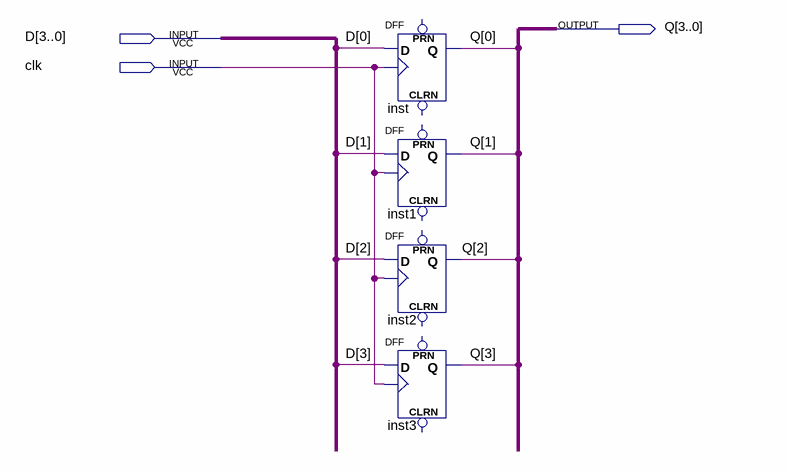
[diagram p0: schematic sheet]
// Quartus schematic reg_4b.bdf as structural Verilog: 4 symbols, 3 pins
module reg_4b (
  input  [3:0] D,
  input  clk,
  output [3:0] Q
);

  DFF inst (.CLK(clk), .D(D[0]), .Q(Q[0]));  // open: CLRN, PRN
  DFF inst1 (.CLK(clk), .D(D[1]), .Q(Q[1]));  // open: CLRN, PRN
  DFF inst2 (.CLK(clk), .D(D[2]), .Q(Q[2]));  // open: CLRN, PRN
  DFF inst3 (.CLK(clk), .D(D[3]), .Q(Q[3]));  // open: CLRN, PRN
endmodule
